# EAGLE design fuji_controller_schematic (EAGLE 9.6.2)
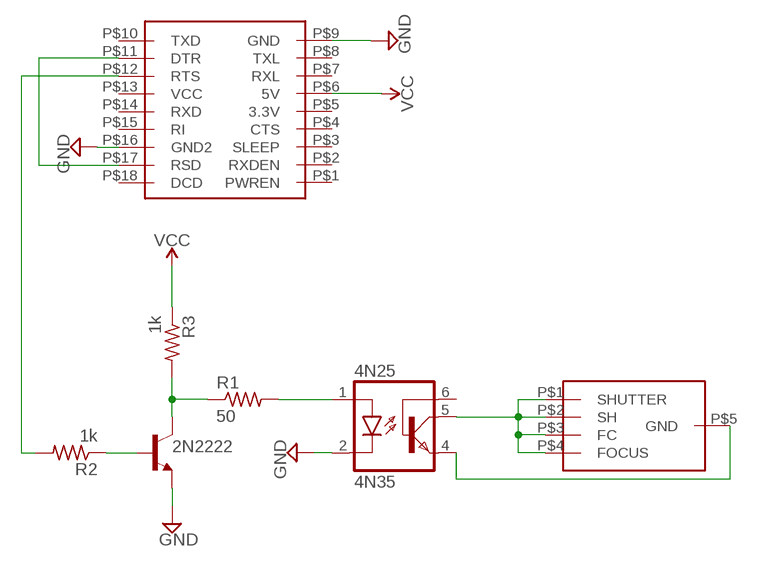
[diagram p0: schematic, sheet 1]

## Parts
2N2222  -NPN-TO92-EBC  [TO92-EBC]
3.5MM  3.5MM_AUDIO_JACK  [3.5MM_AUDIO_JACK]
4N25  4N35  [DIL06]
FTDI  FTDI_BREAKOUT  [FTDI232_BREAKOUT]
R1  50  R-US_0204/7  [0204/7]
R2  1k  R-US_0204/7  [0204/7]
R3  1k  R-US_0204/7  [0204/7]

## Nets
GND: 2N2222.E 4N25.2(C) FTDI.P$9(GND) FTDI.P$16(GND2)
N$1: FTDI.P$11(DTR) FTDI.P$17(RSD)
N$2: FTDI.P$12(RTS) R2.2
N$3: 2N2222.B R2.1
N$4: 2N2222.C R1.1 R3.2
N$5: 4N25.1(A) R1.2
N$6: 3.5MM.P$1(SHUTTER) 3.5MM.P$2(SH) 3.5MM.P$3(FC) 3.5MM.P$4(FOCUS) 4N25.5(COL)
N$8: 3.5MM.P$5(GND) 4N25.4(EMI)
VCC: FTDI.P$6(5V) R3.1
Unconnected: 4N25.6(BAS) FTDI.P$1(PWREN) FTDI.P$2(RXDEN) FTDI.P$3(SLEEP) FTDI.P$4(CTS) FTDI.P$5(3.3V) FTDI.P$7(RXL) FTDI.P$8(TXL) FTDI.P$10(TXD) FTDI.P$13(VCC) FTDI.P$14(RXD) FTDI.P$15(RI) FTDI.P$18(DCD)

## Library data of the parts
2N2222 = transistor:*-NPN-: NPN Transistror BF959 corrected 2008.03.06
3.5MM = CUSTOM:3.5MM_AUDIO_JACK
4N25 = optocoupler:4N35: MOTOROLA OPTO COUPLER; MF: FAIRCHILD SEMICONDUCTOR; MPN: 4N35; OC_FARNELL: 1328375; OC_NEWARK: 72K9946
FTDI = CUSTOM:FTDI_BREAKOUT
R1-R3 = rcl:R-US_: RESISTOR, American symbol; SPICEPREFIX: R

## Board
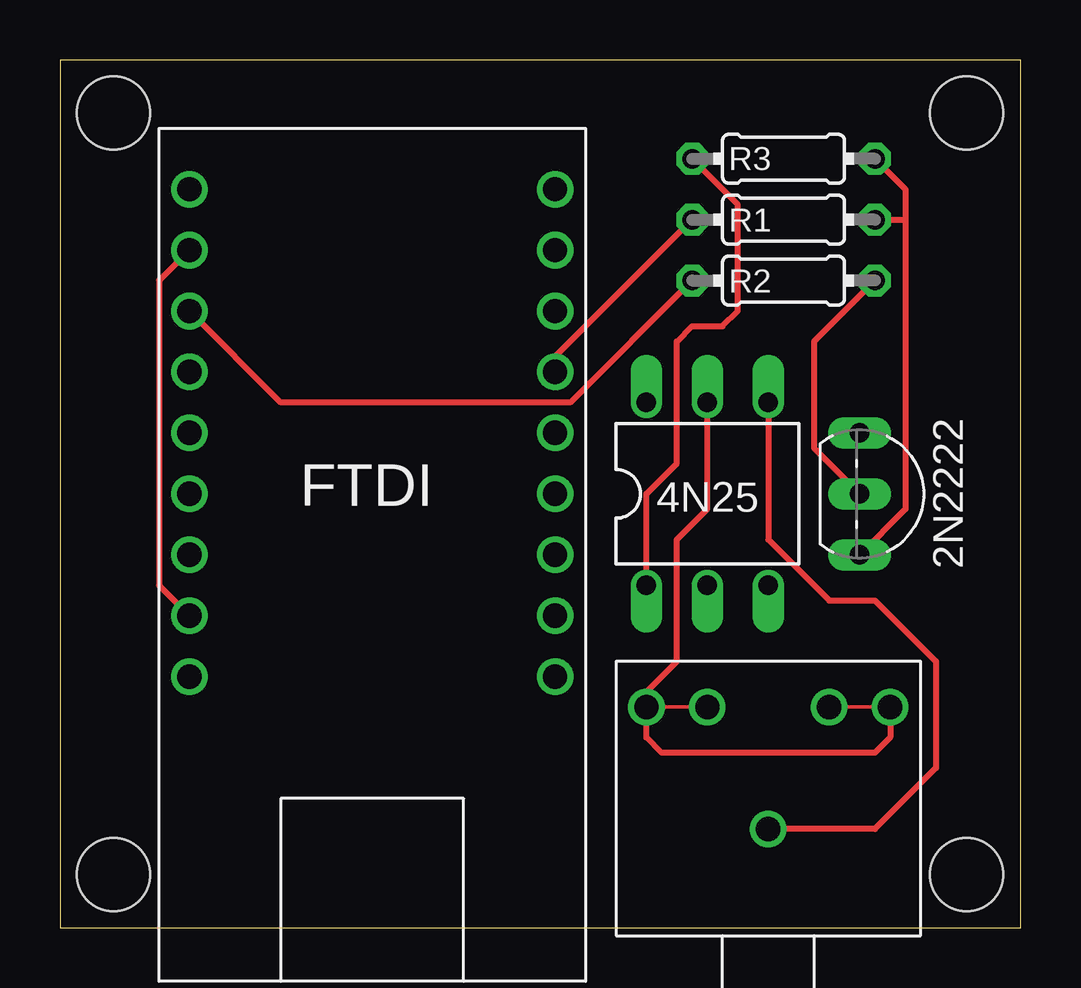
[diagram p1: board, top side]
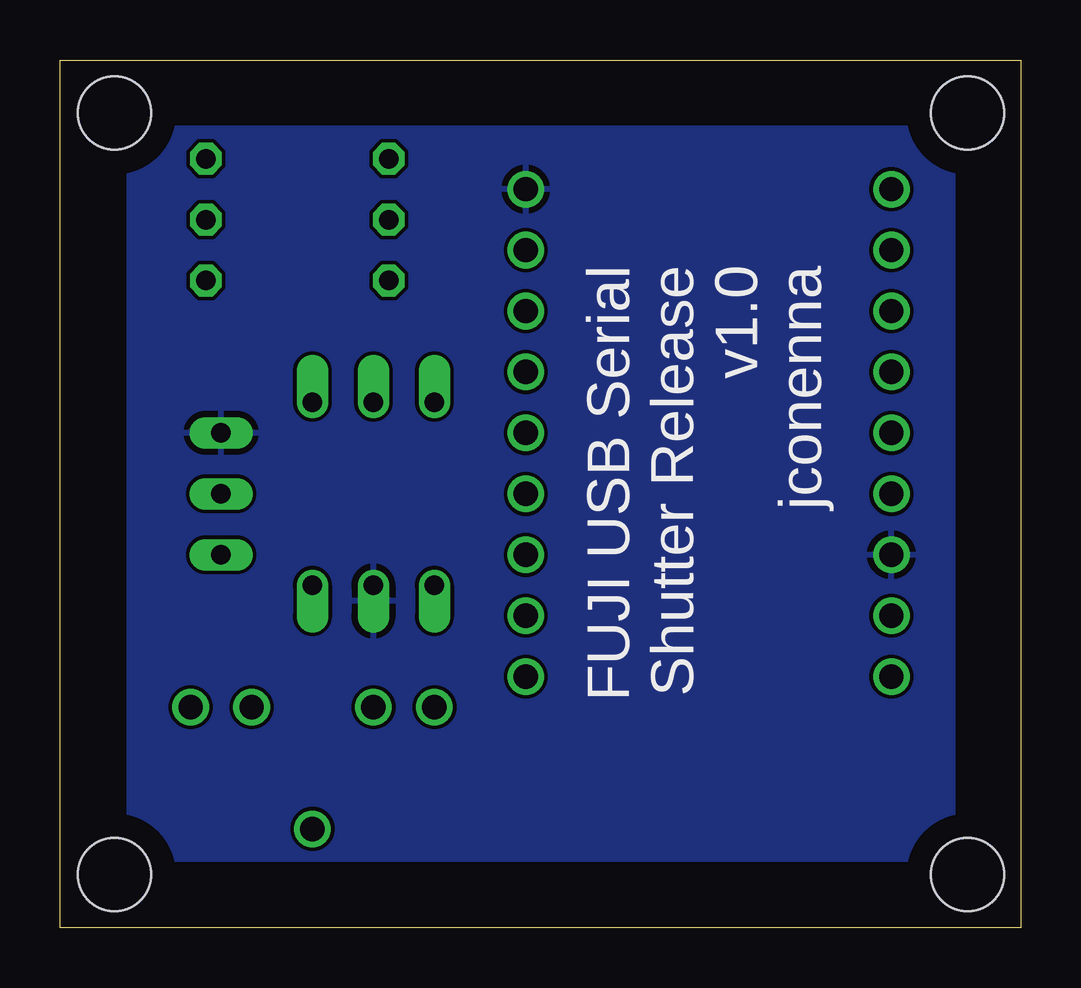
[diagram p2: board, bottom side, seen from below]

Size 40.06 x 36.18 mm. Coordinates in mm from the lower left corner, seen from the top.
Outline: 0,0 40.06,0 40.06,36.18 0,36.18 0,0
Copper layers (1*16): Top 0.035mm / dielectric 1.5mm / Bottom 0.035mm
Design rules "default": minimum track width 6mil, minimum drill 0.35mm, track to track 6mil, track to pad 6mil, pad to pad 6mil, via to via 6mil, smd to smd 6mil, copper to edge 40mil, drill to drill 6mil, minimum pad ring 10mil, minimum via ring 8mil, stop-mask expansion 4mil, vias tented up to drill 0mil, thermal gap 10mil
Holes 3.05 mm at 2.22,33.97 37.78,33.97 2.22,2.22 37.78,2.22

### Footprints (pad centres in the part's own frame; a part is rotated, then mirrored left to right if it is on the bottom)
TO92-EBC = drill 0.813 long: B 0,-1.27; C 2.54,-1.27; E -2.54,-1.27
3.5MM_AUDIO_JACK = drill 1.016: P$1 -5.08,-2.54; P$2 -2.54,-2.54; P$3 2.54,-2.54; P$4 5.08,-2.54; P$5 0,2.54
DIL06 = drill 0.813 offset: 1 -2.54,-3.81; 2 0,-3.81; 3 2.54,-3.81; 4 2.54,3.81; 5 0,3.81; 6 -2.54,3.81
FTDI232_BREAKOUT = drill 1.016: P$1 -7.62,10.16; P$2 -7.62,7.62; P$3 -7.62,5.08; P$4 -7.62,2.54; P$5 -7.62,0; P$6 -7.62,-2.54; P$7 -7.62,-5.08; P$8 -7.62,-7.62; P$9 -7.62,-10.16; P$10 7.62,-10.16; P$11 7.62,-7.62; P$12 7.62,-5.08; P$13 7.62,-2.54; P$14 7.62,0; P$15 7.62,2.54; P$16 7.62,5.08; P$17 7.62,7.62; P$18 7.62,10.16
0204/7 = drill 0.813 octagon: 1 -3.81,0; 2 3.81,0

### Placement (x,y rotation side)
2N2222  34.61,18.1 270 top
3.5MM  29.53,6.67 180 top
4N25  26.99,18.1 0 top
FTDI  13.02,20.64 180 top
R1  30.16,32.07 180 top
R2  30.16,26.99 180 top
R3  30.16,29.53 0 top

### Tracks (layer width: path | path; a pad name or v marks a point on that pad's centre or on a via)
GND
  pour Bottom: 2.86,33.34 2.86,2.86 37.15,2.86 37.15,33.34
N$1
  Top 0.254: FTDI.P$11 4.13,26.99 4.13,14.29 FTDI.P$17
N$2
  Top 0.254: R2.2 21.27,21.91 9.21,21.91 FTDI.P$12
N$3
  Top 0.254: R2.1 31.43,24.45 31.43,20 2N2222.B
N$4
  Top 0.254: R1.1 35.24,30.8 35.24,29.53 | R3.2 35.24,29.53 | 35.24,29.53 35.24,17.46 2N2222.C
N$5
  Top 0.254: 4N25.1 24.45,18.1 25.72,19.37 25.72,24.45 26.35,25.08 27.62,25.08 28.26,25.72 28.26,30.16 R1.2
N$6
  Top 0.152: 3.5MM.P$3 3.5MM.P$4 | 3.5MM.P$1 3.5MM.P$2
  Top 0.254: 3.5MM.P$1 34.61,7.94 33.97,7.3 25.08,7.3 24.45,7.94 3.5MM.P$4 24.45,9.84 25.72,11.11 25.72,16.19 26.99,17.46 4N25.5
N$8
  Top 0.254: 4N25.4 29.53,16.19 32.07,13.65 33.97,13.65 36.51,11.11 36.51,6.67 33.97,4.13 3.5MM.P$5
VCC
  Top 0.254: R3.1 20.64,23.81 FTDI.P$6

### Text on the board
bPlace: FUJI USB Serial / Shutter Release / v1.0 / jconenna